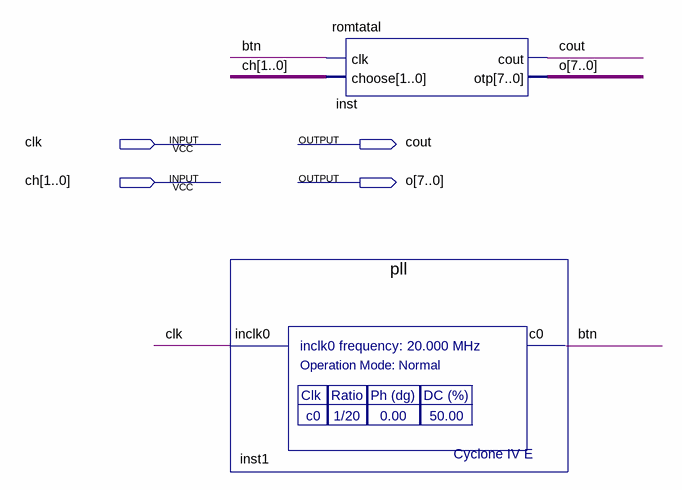
[diagram p0: schematic sheet]
// Quartus schematic rom_test.bdf as structural Verilog: 2 symbols, 4 pins
module rom_test (
  input  clk,
  input  [1:0] ch,
  output cout,
  output [7:0] o
);

  wire btn;

  pll inst1 (.inclk0(clk), .c0(btn));
  romtatal inst (.clk(btn), .choose(ch), .cout(cout), .otp(o));
endmodule
